# Altium schematic sheet FPGA_SPI_JTAG_IO.SchDoc
size A4
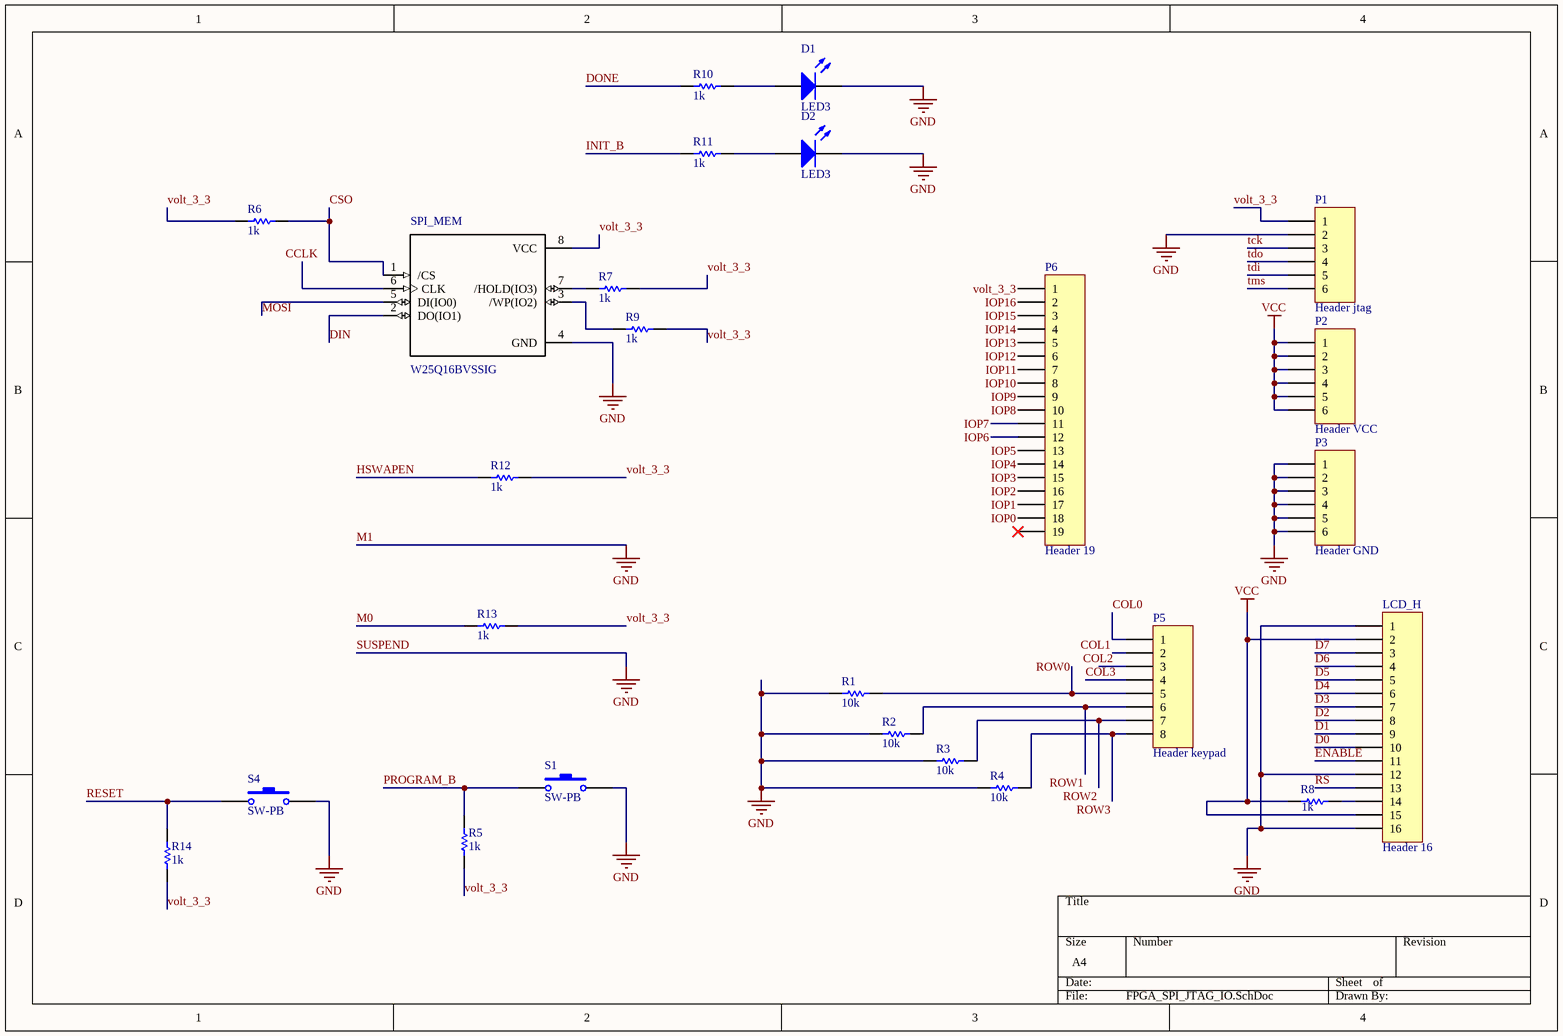
[diagram p0: FPGA_SPI_JTAG_IO.SchDoc]

## Parts
D1  LED3  [3.5X2.8X1.9]
D2  LED3  [3.5X2.8X1.9]
LCD_H  Header 16  [HDR1X16]
P1  Header jtag  [HDR1X6]
P2  Header VCC  [HDR1X6]
P3  Header GND  [HDR1X6]
P5  Header keypad  [HDR1X8]
P6  Header 19  [HDR1X19]
R1  10k  [ERA-0805]
R2  10k  [ERA-0805]
R3  10k  [ERA-0805]
R4  10k  [ERA-0805]
R5  1k  [ERA-0805]
R6  1k  [ERA-0805]
R7  1k  [ERA-0805]
R8  1k  [ERA-0805]
R9  1k  [ERA-0805]
R10  1k  [ERA-0805]
R11  1k  [ERA-0805]
R12  1k  [ERA-0805]
R13  1k  [ERA-0805]
R14  1k  [ERA-0805]
S1  SW-PB  [SPST-2]
S4  SW-PB  [SPST-2]
SPI_MEM  W25Q16BVSSIG  [*SOIC127P790X216-8N]

## Nets
M1: D1.2(K) D2.2(K) LCD_H.1 LCD_H.12 LCD_H.16 P1.2 P3.1 P3.2 P3.3 P3.4 P3.5 P3.6 R1.1 R2.1 R3.1 R4.1 S1.2 S4.2 SPI_MEM.4(GND)  [also labelled GND, SUSPEND]
VCC: LCD_H.2 LCD_H.15 P2.1 P2.2 P2.3 P2.4 P2.5 P2.6 R8.1
CCLK: SPI_MEM.6(CLK)
COL0: P5.1
COL1: P5.2
COL2: P5.3
COL3: P5.4
CSO: R6.2 SPI_MEM.1(/CS)
D0: LCD_H.10
D1: LCD_H.9
D2: LCD_H.8
D3: LCD_H.7
D4: LCD_H.6
D5: LCD_H.5
D6: LCD_H.4
D7: LCD_H.3
DIN: SPI_MEM.2(DO(IO1))
DONE: R10.1
ENABLE: LCD_H.11
HSWAPEN: R12.2
INIT_B: R11.1
IOP0: P6.18
IOP1: P6.17
IOP2: P6.16
IOP3: P6.15
IOP4: P6.14
IOP5: P6.13
IOP6: P6.12
IOP7: P6.11
IOP8: P6.10
IOP9: P6.9
IOP10: P6.8
IOP11: P6.7
IOP12: P6.6
IOP13: P6.5
IOP14: P6.4
IOP15: P6.3
IOP16: P6.2
M0: R13.2
MOSI: SPI_MEM.5(DI(IO0))
PROGRAM_B: R5.2 S1.1
RESET: R14.2 S4.1
ROW0: P5.5 R1.2
ROW1: P5.6 R2.2
ROW2: P5.7 R3.2
ROW3: P5.8 R4.2
RS: LCD_H.13
tck: P1.3
tdi: P1.5
tdo: P1.4
tms: P1.6
volt_3_3: P1.1 P6.1 R5.1 R6.1 R7.1 R9.1 R12.1 R13.1 R14.1 SPI_MEM.8(VCC)
NetD1_1: D1.1(A) R10.2
NetD2_1: D2.1(A) R11.2
NetLCD_H_14: LCD_H.14 R8.2
NetR7_2: R7.2 SPI_MEM.7(/HOLD(IO3))
NetR9_2: R9.2 SPI_MEM.3(/WP(IO2))

Not connected (* = marked no-connect by the designer): P6 19*

## Library data of the parts
D1 D2 = LED3: Typical BLUE SiC LED; Published: 8-Jun-2000; LatestRevisionDate: 17-Dec-2003; LatestRevisionNote: PCB Footprint replaced.; DatasheetVersion: 16-Apr-2002; PackageVersion: 16-Apr-2002; PackageReference: 3.5X2.8X1.9; Publisher: Altium Limited; PackageDescription: SM LED; 2 C-Bend Leads; Body 3.5 x 2.8 x 1.9 mm, inc leads (LxWxH typ)
LCD_H = Header 16: Header, 16-Pin; LatestRevisionDate: 17-Jul-2002; LatestRevisionNote: Re-released for DXP Platform.; Publisher: Altium Limited
P1-P3 = Header 6: Header, 6-Pin; LatestRevisionDate: 17-Jul-2002; LatestRevisionNote: Re-released for DXP Platform.; Publisher: Altium Limited
P5 = Header 8: Header, 8-Pin; LatestRevisionDate: 17-Jul-2002; LatestRevisionNote: Re-released for DXP Platform.; Publisher: Altium Limited
P6 = Header 19: Header, 19-Pin; LatestRevisionDate: 17-Jul-2002; LatestRevisionNote: Re-released for DXP Platform.; Publisher: Altium Limited
R1-R14 = ERA6Y: Rectangular Thick Film Chip Resistor, 10 Ohm to 1M Ohm Range, 0.1% and 0.5% Tolerance, 0805 Size, 0.1 W; Note: If flow soldering, adjust pad width of PCB Footprint to 0.7 - 0.8 times the width of the resistor.; Published: 17-Dec-2003; LatestRevisionDate: 19-Mar-2004; LatestRevisionNote: Silkscreen size reduced.; PackageDocument: Mar-2003; PackageReference: ERA-0805; Publisher: Altium Limited; Code_IPC: 2012 [0805]; ComponentLink1Description: Manufacturer Link; ComponentLink1URL: http://www.panasonic.com/industrial/components/resistive_products.htm; ComponentLink2Description: Datasheet; ComponentLink2URL: http://www.panasonic.com/industrial/components/pdf/AOA0000CE8.pdf
S1 S4 = SW-PB: Switch; Published: 24-Mar-1999; LatestRevisionDate: 17-Jul-2002; LatestRevisionNote: Re-released for DXP Platform.; PackageReference: SPST-2; Publisher: Altium Limited; PackageDescription: Switch; 2 Leads
SPI_MEM = W25Q16BVSSIG: Flash, pin, soic, flash, Memory, Semiconductors and Actives, serial, ic; MF: Winbond; SnapEDA_Link: https://www.snapeda.com/parts/W25Q16BVSSIG/Winbond%20Electronics/view-part/?ref=snap; Digi-Key_Part_Number: W25Q16BVSSIG-ND; MP: W25Q16BVSSIG; Digi-Key_Purchase_URL: https://www.digikey.com/product-detail/en/winbond-electronics/W25Q16BVSSIG/W25Q16BVSSIG-ND/2208449?utm_source=snapeda&utm_medium=aggregator&utm_campaign=symbol; Package: SOIC-8 Winbond; Value: *